# Altium schematic sheet Calefactor.SchDoc
size A
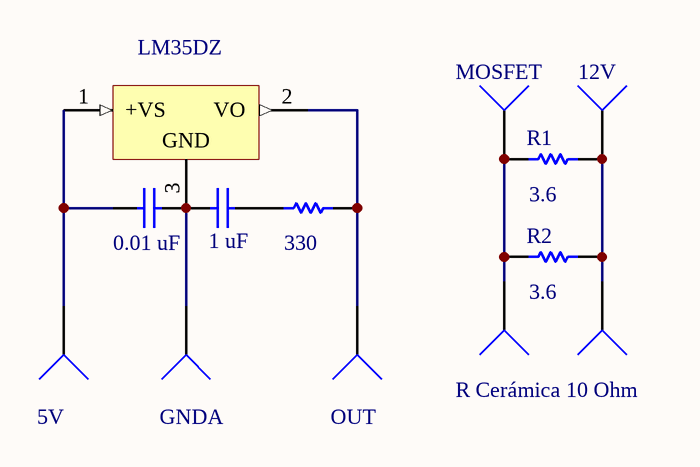
[diagram p0: Calefactor.SchDoc]

## Parts
C1  0.01 uF  [KEMT-C315-THT-2]
C2  1 uF  [KEMT-C315-THT-2]
J1  12V  [PIN1]
J2  MOSFET  [PIN1]
J3  12 V  [PIN1]  (value not drawn)
J4  MOSFET  [PIN1]  (value not drawn)
J5  GNDA  [PIN1]
J6  OUT  [PIN1]
J7  5V  [PIN1]
R1  value 3.6  [AXIAL-0.3]  (hidden comment: Res1)
R2  value 3.6  [AXIAL-0.3]  (hidden comment: Res1)
R3  value 330  [AXIAL-0.3]  (hidden comment: Res2)
U1  LM35DZ  [Z03A]

## Nets
NetC1_1: C1.1 C2.2 J5.1 U1.3(GND)
NetC1_2: C1.2 J7.1 U1.1(+VS)
NetC2_1: C2.1 R3.1
NetJ1_1: J1.1 J3.1 R1.2 R2.2
NetJ2_1: J2.1 J4.1 R1.1 R2.1
NetJ6_1: J6.1 R3.2 U1.2(VO)

## Notes on the sheet
- R Cerámica 10 Ohm

## Library data of the parts
C1 C2 = CMP-1664-00010-1: Capacitor, Ceramic, 1000 pF, +/-10 %, 100 V, X7R, -55 to 125 degC, 2-Pin THD, RoHS, Bulk; Max Supply Voltage: 3.6 V; Case\Package: DFN; Nominal Supply Voltage: 3 V; Min Supply Voltage: 1.5 V; Interface: Serial; ComponentLink1Description: Manufacturer URL; ComponentLink1URL: http://www.kemet.com/; DatasheetVersion: Aug-16; Max Operating Temperature: 125 degC; REACH SVHC: Unknown; Min Operating Temperature: -40 degC; Radiation Hardening: No; Mount: Surface Mount; Packaging: Tape and Reel; PackageDescription: 2-Pin Through Hole Device, Body 3.81 x 2.54 mm; RoHSCompliant: true; PackageReference: C315-THT-2; ComponentLink2URL: http://capacitoredge.kemet.com/capedge2/DataSheet/Datasheet-C315C102K1R5TA.pdf?pn=C315C102K1R5TA{BULK}; ComponentLink2Description: Datasheet; Pins: 6
J1-J7 = Socket: LatestRevisionDate: 17-Jul-2002; LatestRevisionNote: Re-released for DXP Platform.; Publisher: Altium Limited
R1-R3 = Res1: Resistor; Published: 8-Jun-2000; LatestRevisionDate: 17-Jul-2002; LatestRevisionNote: Re-released for DXP Platform.; PackageReference: AXIAL-0.3; Publisher: Altium Limited; PackageDescription: Axial Device, Thru-Hole; 2 Leads; 0.3 in Pin Spacing
U1 = CMP-0066-00031-2: Precision Centigrade Temperature Sensor, 3-pin TO-92; Manufacturer: National Semiconductor; PowerWise: N; PackageTopMarking: NSXYTT*LM35*DZ; CompType: Temp Sensor IC; PackageReference: Z03A; PinCount: 3; ComponentLink2URL: http://www.national.com/pf/LM/LM35.html; Code_JEDEC: TO-226-AA; RoHS: N; PackageVersion: revG, Sep-2000; ComponentLink2Description: LM35 Web Page; ComponentLink1URL: http://www.national.com/ds/LM/LM35.pdf; RevisionNote: Component URLs added; ComponentLink3URL: http://www.national.com/packaging/folders/z03a.html; PackageDescription: TO-92, Molded, 3 Lead; ComponentLink3Description: Z03A Package Page; DatasheetVersion: Nov-2000; ComponentLink1Description: LM35 Datasheet